# EAGLE schematic toets1 (EAGLE 9.7.0)
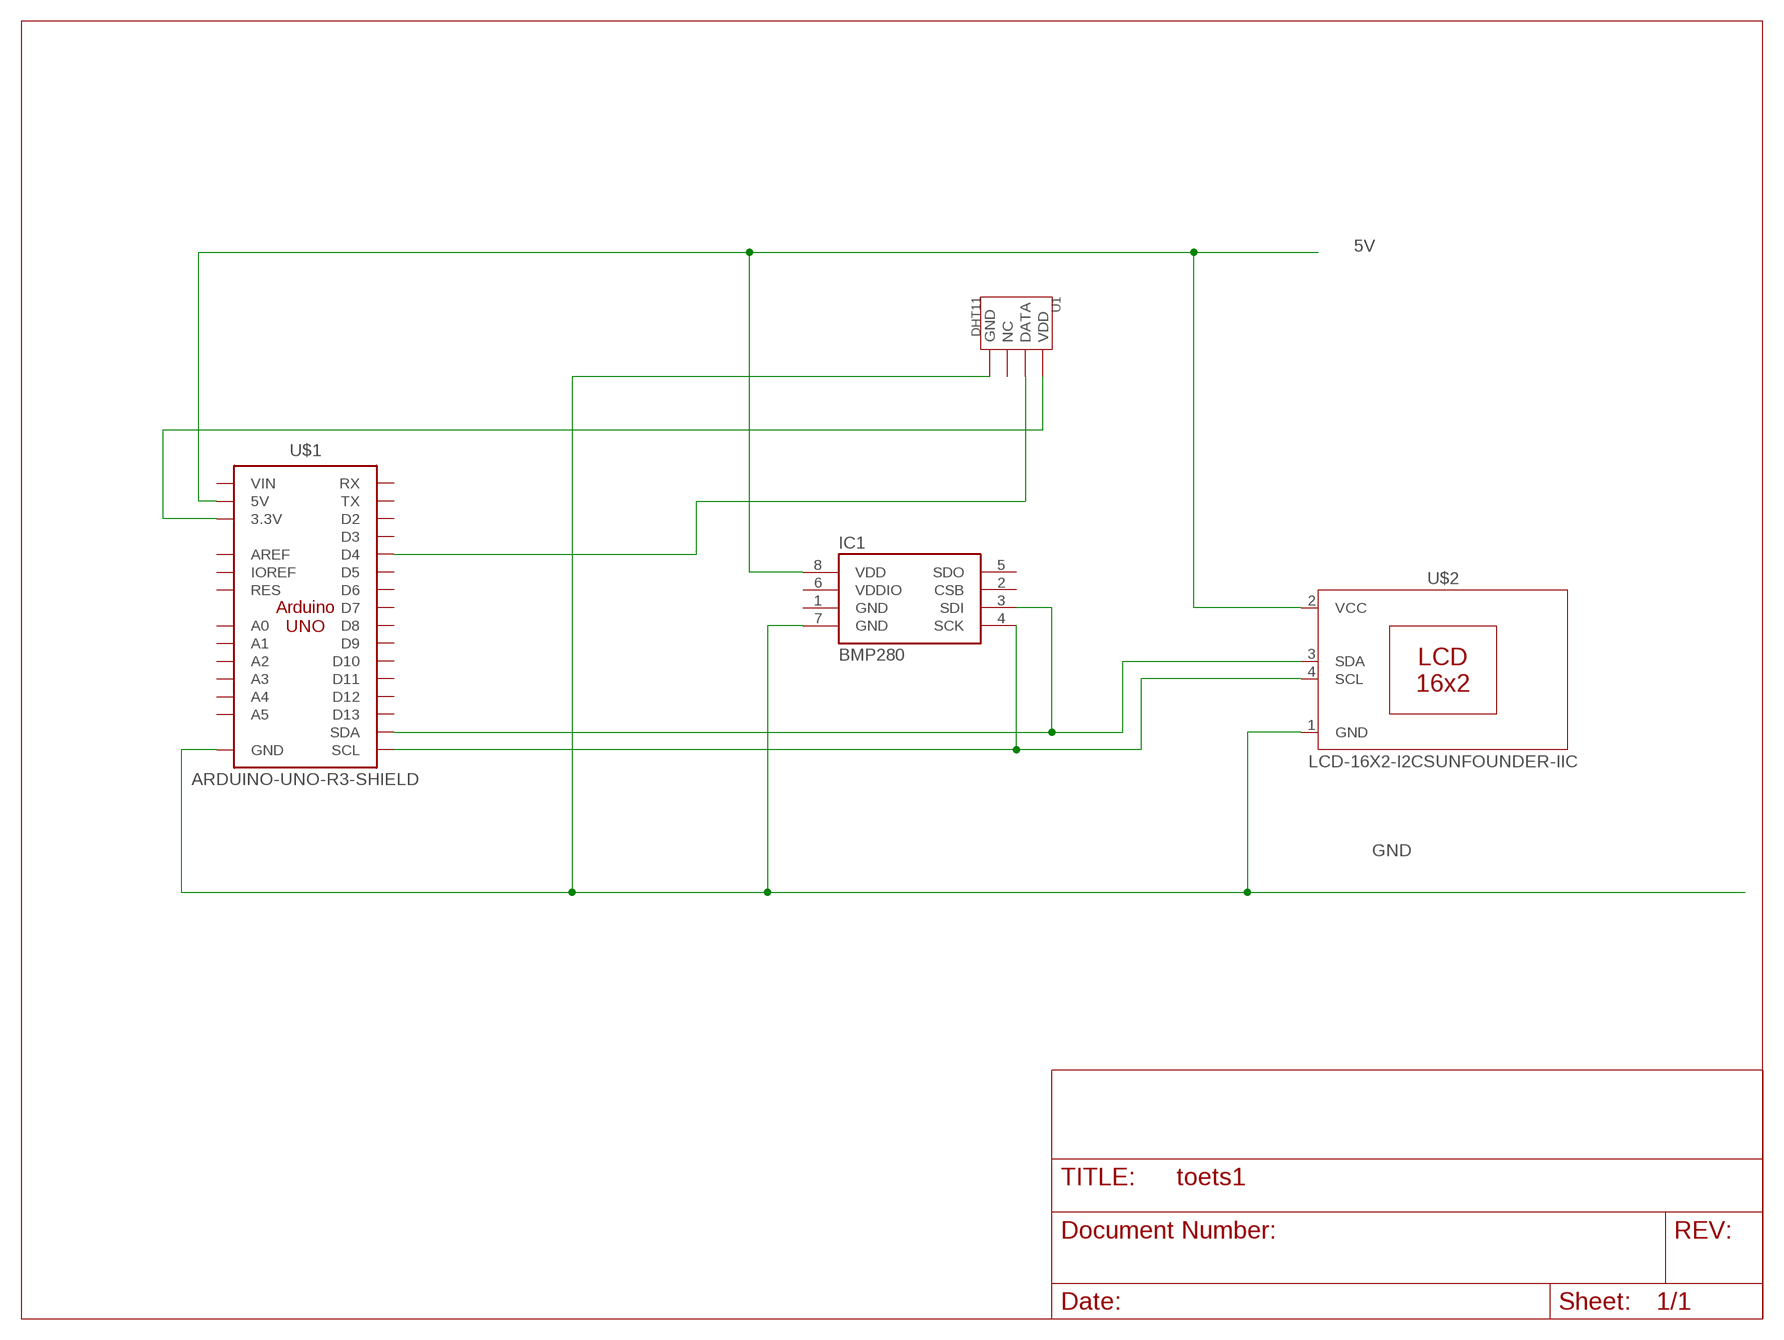
[diagram p0: schematic, sheet 1]

## Parts
IC1  BMP280  [BMP280]
U1  DHT11  TEM-HUM-DHT11(4P-15.5X12.0MM)  [SNR4-2.54-15.5X12.0X5.5MM]
U$1  ARDUINO-UNO-R3-SHIELD  [ARDUINO-UNO-R3-SHIELD]
U$2  LCD-16X2-I2CSUNFOUNDER-IIC  [LCD-I2C]

## Nets
5V: IC1.8(VDD) U$1.5V U$2.2(VCC)
GND: IC1.7(GND) U1.4(GND) U$1.GND@0(GND) U$1.GND@1(GND) U$1.GND@2(GND) U$2.1(GND)
N$2: U1.2(DATA) U$1.D4
N$3: IC1.4(SCK) U$1.SCL U$2.4(SCL)
N$4: IC1.3(SDI) U$1.SDA U$2.3(SDA)
VDD: U1.1(VDD) U$1.3.3V
Unconnected: IC1.2(CSB) IC1.5(SDO) IC1.6(VDDIO) U1.3(NC) U$1.A0 U$1.A1 U$1.A2 U$1.A3 U$1.A4 U$1.A5 U$1.AREF U$1.D2 U$1.D3 U$1.D5 U$1.D6 U$1.D7 U$1.D8 U$1.D9 U$1.D10 U$1.D11 U$1.D12 U$1.D13 U$1.IOREF U$1.RES U$1.RX U$1.TX U$1.VIN

## Power pins joined to a net without a drawn wire
GND: IC1.1(GND)

## Library data of the parts
IC1 = BeagleBone_Blue_R3:BMP280: BOSCH BMP280 Digital Pressure Sensor
U1 = OPL_Sensor-Transducer:TEM-HUM-DHT11(4P-15.5X12.0MM): 314010000
U$1 = Tinkercad:ARDUINO-UNO-R3-SHIELD
U$2 = Tinkercad:LCD-16X2-I2C